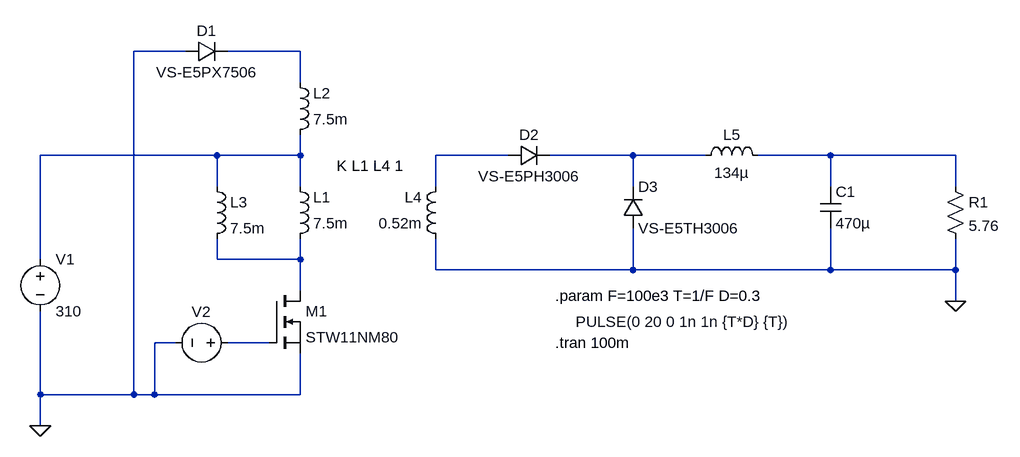
[diagram p0: schematic forward_converter_v1.asc]
forward_converter_v1.asc, the LTspice schematic file:
Version 4.1
SHEET 1 1456 680
WIRE 192 -80 112 -80
WIRE 368 -80 256 -80
WIRE 368 -32 368 -80
WIRE 240 80 -32 80
WIRE 368 80 368 48
WIRE 368 80 240 80
WIRE 688 80 576 80
WIRE 880 80 752 80
WIRE 992 80 880 80
WIRE 1184 80 1072 80
WIRE 1376 80 1184 80
WIRE 240 128 240 80
WIRE 368 128 368 80
WIRE 576 128 576 80
WIRE 880 128 880 80
WIRE 1184 128 1184 80
WIRE 1376 128 1376 80
WIRE -32 240 -32 80
WIRE 240 240 240 208
WIRE 368 240 368 208
WIRE 368 240 240 240
WIRE 576 256 576 208
WIRE 880 256 880 192
WIRE 880 256 576 256
WIRE 1184 256 1184 192
WIRE 1184 256 880 256
WIRE 1376 256 1376 208
WIRE 1376 256 1184 256
WIRE 368 288 368 240
WIRE 1376 304 1376 256
WIRE 176 368 144 368
WIRE 320 368 256 368
WIRE -32 448 -32 320
WIRE 112 448 112 -80
WIRE 112 448 -32 448
WIRE 144 448 144 368
WIRE 144 448 112 448
WIRE 368 448 368 384
WIRE 368 448 144 448
WIRE -32 496 -32 448
FLAG -32 496 0
FLAG 1376 304 0
SYMBOL voltage -32 224 R0
WINDOW 123 0 0 Left 0
WINDOW 39 0 0 Left 0
SYMATTR InstName V1
SYMATTR Value 310
SYMBOL ind 352 224 M180
WINDOW 0 36 80 Left 2
WINDOW 3 36 40 Left 2
SYMATTR InstName L1
SYMATTR Value 7.5m
SYMATTR Type ind
SYMBOL ind 592 224 R180
WINDOW 0 36 80 Left 2
WINDOW 3 36 40 Left 2
SYMATTR InstName L4
SYMATTR Value 0.52m
SYMATTR Type ind
SYMBOL nmos 320 288 R0
SYMATTR InstName M1
SYMATTR Value STW11NM80
SYMBOL diode 192 -96 M90
WINDOW 0 0 32 VBottom 2
WINDOW 3 32 32 VTop 2
SYMATTR InstName D1
SYMATTR Value VS-E5PX7506
SYMBOL voltage 272 368 R90
WINDOW 0 -32 56 VBottom 2
WINDOW 3 -48 -686 VTop 2
WINDOW 123 0 0 Left 0
WINDOW 39 0 0 Left 0
SYMATTR InstName V2
SYMATTR Value PULSE(0 20 0 1n 1n {T*D} {T})
SYMBOL diode 688 96 R270
WINDOW 0 32 32 VTop 2
WINDOW 3 0 32 VBottom 2
SYMATTR InstName D2
SYMATTR Value VS-E5PH3006
SYMBOL diode 864 192 M180
WINDOW 0 24 64 Left 2
WINDOW 3 24 0 Left 2
SYMATTR InstName D3
SYMATTR Value VS-E5TH3006
SYMBOL ind 976 96 R270
WINDOW 0 32 56 VTop 2
WINDOW 3 5 56 VBottom 2
SYMATTR InstName L5
SYMATTR Value 134µ
SYMBOL cap 1168 128 R0
SYMATTR InstName C1
SYMATTR Value 470µ
SYMBOL res 1360 112 R0
SYMATTR InstName R1
SYMATTR Value 5.76
SYMBOL ind 352 64 M180
WINDOW 0 36 80 Left 2
WINDOW 3 36 40 Left 2
SYMATTR InstName L2
SYMATTR Value 7.5m
SYMATTR Type ind
SYMBOL ind 224 112 R0
SYMATTR InstName L3
SYMATTR Value 7.5m
TEXT 760 296 Left 2 !.param F=100e3 T=1/F D=0.3
TEXT 424 96 Left 2 !K L1 L4 1
TEXT 760 368 Left 2 !.tran 100m

The netlist it stands for:
* forward_converter_v1.asc
V1 N002 0 310
L1 N006 N002 7.5m
L4 0 N003 0.52m
M1 N006 N007 0 0 STW11NM80
D1 0 N001 VS-E5PX7506
V2 N007 0 PULSE(0 20 0 1n 1n {T*D} {T})
D2 N003 N004 VS-E5PH3006
D3 0 N004 VS-E5TH3006
L5 N004 N005 134µ
C1 N005 0 470µ
R1 N005 0 5.76
L2 N002 N001 7.5m
L3 N002 N006 7.5m
.model D D
.lib standard.dio
.model NMOS NMOS
.model PMOS PMOS
.lib standard.mos
.param F=100e3 T=1/F D=0.3
K L1 L4 1
.tran 100m
.backanno
.end